# Altium schematic sheet DTMF.SchDoc
size A4
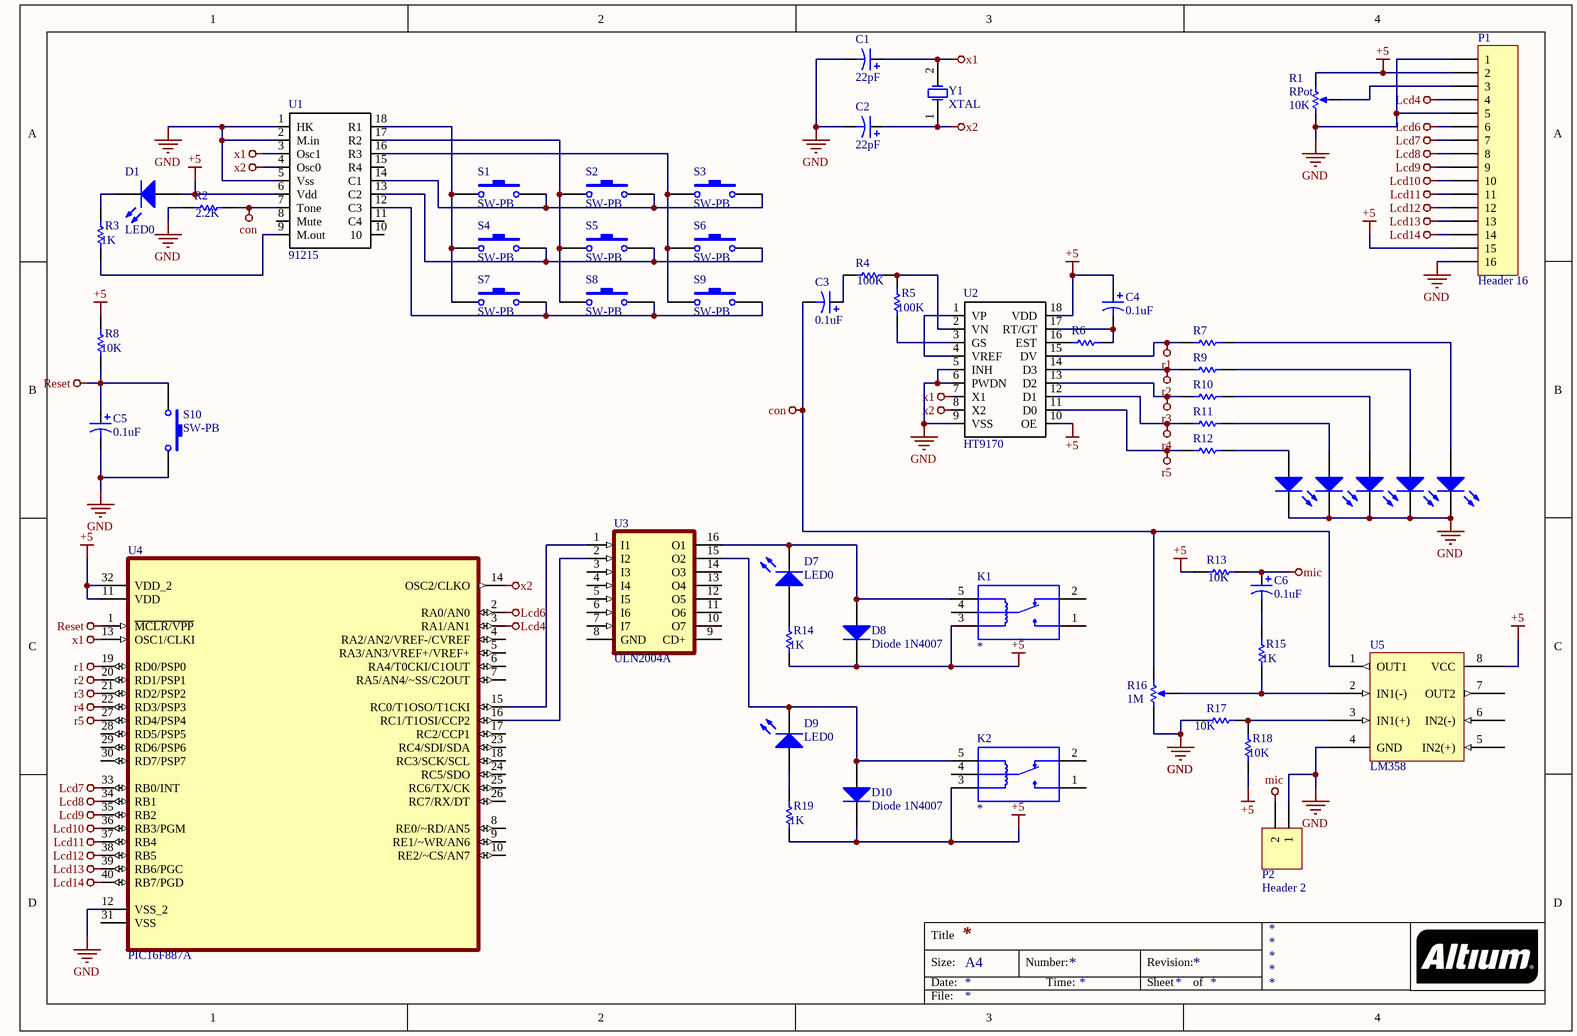
[diagram p0: DTMF.SchDoc]

## Parts
C1  value 22pF  [capacitor]  (hidden comment: cap)
C2  value 22pF  [capacitor]  (hidden comment: cap)
C3  value 0.1uF  [capacitor]  (hidden comment: cap)
C4  value 0.1uF  [capacitor]  (hidden comment: cap)
C5  value 0.1uF  [capacitor]  (hidden comment: cap)
C6  value 0.1uF  [capacitor]  (hidden comment: cap)
D1  LED0  [LED-0]
D2  LED0  [LED-0]  (value not drawn)
D3  LED0  [LED-0]  (value not drawn)
D4  LED0  [LED-0]  (value not drawn)
D5  LED0  [LED-0]  (value not drawn)
D6  LED0  [LED-0]  (value not drawn)
D7  LED0  [LED-0]
D8  Diode 1N4007  [DO-41]
D9  LED0  [LED-0]
D10  Diode 1N4007  [DO-41]
K1  1-1721150-0  [RELAY_ORWH-SH-105D1F,000]  (value not drawn)
K2  1-1721150-0  [RELAY_ORWH-SH-105D1F,000]  (value not drawn)
P1  Header 16  [HDR1X16]
P2  Header 2  [HDR1X2]
R1  RPot  value 10K  [VR5]
R2  value 2.2K  [AXIAL-0.3]  (hidden comment: Res1)
R3  value 1K  [AXIAL-0.3]  (hidden comment: Res1)
R4  value 100K  [AXIAL-0.3]  (hidden comment: Res1)
R5  value 100K  [AXIAL-0.3]  (hidden comment: Res1)
R6  Res1  [AXIAL-0.3]  (value not drawn)
R7  Res1  [AXIAL-0.3]  (value not drawn)
R8  value 10K  [AXIAL-0.3]  (hidden comment: Res1)
R9  Res1  [AXIAL-0.3]  (value not drawn)
R10  Res1  [AXIAL-0.3]  (value not drawn)
R11  Res1  [AXIAL-0.3]  (value not drawn)
R12  Res1  [AXIAL-0.3]  (value not drawn)
R13  value 10K  [AXIAL-0.3]  (hidden comment: Res1)
R14  value 1K  [AXIAL-0.3]  (hidden comment: Res1)
R15  value 1K  [AXIAL-0.3]  (hidden comment: Res1)
R16  value 1M  [VR5]  (hidden comment: RPot)
R17  value 10K  [AXIAL-0.3]  (hidden comment: Res1)
R18  value 10K  [AXIAL-0.3]  (hidden comment: Res1)
R19  value 1K  [AXIAL-0.3]  (hidden comment: Res1)
S1  SW-PB  [SPST-2]
S2  SW-PB  [SPST-2]
S3  SW-PB  [SPST-2]
S4  SW-PB  [SPST-2]
S5  SW-PB  [SPST-2]
S6  SW-PB  [SPST-2]
S7  SW-PB  [SPST-2]
S8  SW-PB  [SPST-2]
S9  SW-PB  [SPST-2]
S10  SW-PB  [SPST-2]
U1  91215  [HT9170]
U2  HT9170  [HT9170]
U3  ULN2004A  [ULN2004A]
U4  PIC16F887A  [PIC16F887A]
U5  LM358  [LM358]
Y1  XTAL  [R38]

## Nets
+5: C4.1 D1.1(A) D8.2(K) D10.2(K) K1.3(C1) K2.3(C1) P1.2 P1.15 R1.2(BOT) R8.2 R13.1 R14.1 R18.1 R19.1 U1.6(Vdd) U2.10(OE) U2.18(VDD) U4.11(VDD) U4.32(VDD_2) U5.8(VCC)
con: C3.2 R2.2 R16.2(BOT) U1.7(Tone) U5.1(OUT1)
GND: C1.2 C2.2 C5.2 D2.2(K) D3.2(K) D4.2(K) D5.2(K) D6.2(K) P1.1 P1.5 P1.16 P2.1 R1.1(TOP) R2.1 R16.1(TOP) R17.1 S10.2 U1.1(HK) U1.2(M.in) U1.5(Vss) U2.5(INH) U2.6(PWDN) U2.9(VSS) U4.12(VSS_2) U5.4(GND)
Lcd4: P1.4 U4.3(RA1/AN1)
Lcd6: P1.6 U4.2(RA0/AN0)
Lcd7: P1.7 U4.33(RB0/INT)
Lcd8: P1.8 U4.34(RB1)
Lcd9: P1.9 U4.35(RB2)
Lcd10: P1.10 U4.36(RB3/PGM)
Lcd11: P1.11 U4.37(RB4)
Lcd12: P1.12 U4.38(RB5)
Lcd13: P1.13 U4.39(RB6/PGC)
Lcd14: P1.14 U4.40(RB7/PGD)
mic: C6.1 P2.2 R13.2
r1: R7.1 U2.15(DV) U4.19(RD0/PSP0)
r2: R9.1 U2.14(D3) U4.20(RD1/PSP1)
r3: R10.1 U2.13(D2) U4.21(RD2/PSP2)
r4: R11.1 U2.12(D1) U4.22(RD3/PSP3)
r5: R12.1 U2.11(D0) U4.27(RD4/PSP4)
Reset: C5.1 R8.1 S10.1 U4.1(~{MCLR/VPP})
x1: C1.1 U1.3(Osc1) U2.7(X1) U4.13(OSC1/CLKI) Y1.2(OSC2)
x2: C2.1 U1.4(Osc0) U2.8(X2) U4.14(OSC2/CLKO) Y1.1(OSC1)
NetC3_1: C3.1 R4.1
NetC4_2: C4.2 R6.2 U2.17(RT/GT)
NetC6_2: C6.2 R15.2
NetD1_2: D1.2(K) R3.2
NetD2_1: D2.1(A) R12.2
NetD3_1: D3.1(A) R11.2
NetD4_1: D4.1(A) R10.2
NetD5_1: D5.1(A) R9.2
NetD6_1: D6.1(A) R7.2
NetD7_1: D7.1(A) R14.2
NetD7_2: D7.2(K) D8.1(A) K1.5(C2) U3.16(O1)
NetD9_1: D9.1(A) R19.2
NetD9_2: D9.2(K) D10.1(A) K2.5(C2) U3.15(O2)
NetP1_3: P1.3 R1.3(TAP)
NetR3_1: R3.1 U1.9(M.out)
NetR4_2: R4.2 R5.2 U2.2(VN)
NetR5_1: R5.1 U2.3(GS)
NetR6_1: R6.1 U2.16(EST)
NetR15_1: R15.1 R16.3(TAP) U5.2(IN1(-))
NetR17_2: R17.2 R18.2 U5.3(IN1(+))
NetS1_1: S1.1 S4.1 S7.1 U1.18(R1)
NetS1_2: S1.2 S2.2 S3.2 U1.14(C1)
NetS2_1: S2.1 S5.1 S8.1 U1.17(R2)
NetS3_1: S3.1 S6.1 S9.1 U1.16(R3)
NetS4_2: S4.2 S5.2 S6.2 U1.13(C2)
NetS7_2: S7.2 S8.2 S9.2 U1.12(C3)
NetU2_1: U2.1(VP) U2.4(VREF)
NetU3_1: U3.1(I1) U4.15(RC0/T1OSO/T1CKI)
NetU3_2: U3.2(I2) U4.16(RC1/T1OSI/CCP2)

Not connected (* = marked no-connect by the designer): K1 1(NO) 2(NC) 4(C); K2 1(NO) 2(NC) 4(C); U1 8(Mute) 10 11(C4) 15(R4); U3 3(I3) 4(I4) 5(I5) 6(I6) 7(I7) 8(GND) 9(CD+) 10(O7) 11(O6) 12(O5) 13(O4) 14(O3); U4 4(RA2/AN2/VREF-/CVREF) 5(RA3/AN3/VREF+/VREF+) 6(RA4/T0CKI/C1OUT) 7(RA5/AN4/~SS/C2OUT) 8(RE0/~RD/AN5) 9(RE1/~WR/AN6) 10(RE2/~CS/AN7) 17(RC2/CCP1) 18(RC3/SCK/SCL) 23(RC4/SDI/SDA) 24(RC5/SDO) 25(RC6/TX/CK) 26(RC7/RX/DT) 28(RD5/PSP5) 29(RD6/PSP6) 30(RD7/PSP7) 31(VSS); U5 5(IN2(+)) 6(IN2(-)) 7(OUT2)

## Notes on the sheet
- Title
- Size:
- Date:
- A4
- Number:
- Time:
- Revision:
- Sheet
- of
- File:

## Library data of the parts
D1-D7 D9 = LED0: Typical INFRARED GaAs LED; Published: 8-Jun-2000; LatestRevisionDate: 08-Jul-2005; LatestRevisionNote: Mech Layer 1 removed.; PackageReference: LED-0; Publisher: Altium Limited; PackageDescription: LED; 2 Leads
D8 D10 = Diode 1N4007: 1 Amp General Purpose Rectifier; Published: 8-Jun-2000; LatestRevisionDate: 17-Jul-2002; LatestRevisionNote: Re-released for DXP Platform.; DatasheetVersion: 1998; PackageVersion: Aug-1999; PackageReference: DO-41; Publisher: Altium Limited; PackageDescription: Diode, Axial; Body 5.2 x 2.7 mm (LxDia. max), Lead Dia. 0.86 mm (max); Code_JEDEC: DO-204-AL; ComponentLink1Description: Manufacturer Link; ComponentLink1URL: http://www.fairchildsemi.com/; ComponentLink2Description: Datasheet; ComponentLink2URL: http://www.fairchildsemi.com/ds/1N%2F1N4001.pdf
K1 K2 = ORWH-SH-105D1F,000: Electromechanical Relay 5VDC 15A SPDT __ 19.2mm 15.5mm 15mm__ THT General Purpose Relay; MF: TE Connectivity; Price: None; Value: *; TE_purchase_URL: https://www.te.com/usa-en/product-1-1721150-0.html?te_bu=Cor&te_type=disp&te_campaign=seda_glo_cor-seda-global-disp-prtnr-fy19-seda-model-bom-cta_sma-317_1&elqCampaignId=32493; Package: None; SnapEDA_Link: https://www.snapeda.com/parts/ORWH-SH-105D1F%2C000/TE%20Connectivity%20Potter%20%26%20Brumfield%20Relays/view-part/573992/?ref=snap; MP: ORWH-SH-105D1F,000; Availability: Unavailable; Comment_1: *
P1 = Header 16: Header, 16-Pin; LatestRevisionDate: 17-Jul-2002; LatestRevisionNote: Re-released for DXP Platform.; Publisher: Altium Limited
P2 = Header 2: Header, 2-Pin; LatestRevisionDate: 17-Jul-2002; LatestRevisionNote: Re-released for DXP Platform.; Publisher: Altium Limited
R1 R16 = RPot: Potentiometer; Sim Note: Enter the Resistance value and the set point into parameter fields.; Set Position: 0.5; Published: 8-Jun-2000; LatestRevisionDate: 17-Jul-2002; LatestRevisionNote: Re-released for DXP Platform.; PackageReference: VR5; Publisher: Altium Limited; PackageDescription: Variable Resistor, Thru-Hole; 3 Leads
R2-R5 R8 R13-R15 R17-R19 = Res1: Resistor; Published: 8-Jun-2000; LatestRevisionDate: 17-Jul-2002; LatestRevisionNote: Re-released for DXP Platform.; PackageReference: AXIAL-0.3; Publisher: Altium Limited; PackageDescription: Axial Device, Thru-Hole; 2 Leads; 0.3 in Pin Spacing
R6 = Res1: Resistor; Value: 330; Published: 8-Jun-2000; LatestRevisionDate: 17-Jul-2002; LatestRevisionNote: Re-released for DXP Platform.; PackageReference: AXIAL-0.3; Publisher: Altium Limited; PackageDescription: Axial Device, Thru-Hole; 2 Leads; 0.3 in Pin Spacing
R7 R9-R12 = Res1: Resistor; Value: 4.7K; Published: 8-Jun-2000; LatestRevisionDate: 17-Jul-2002; LatestRevisionNote: Re-released for DXP Platform.; PackageReference: AXIAL-0.3; Publisher: Altium Limited; PackageDescription: Axial Device, Thru-Hole; 2 Leads; 0.3 in Pin Spacing
S1-S10 = SW-PB: Switch; Published: 24-Mar-1999; LatestRevisionDate: 17-Jul-2002; LatestRevisionNote: Re-released for DXP Platform.; PackageReference: SPST-2; Publisher: Altium Limited; PackageDescription: Switch; 2 Leads
U2 = HT9170: MF: Holtek; MP: HT9170B; Price: None; Value: *; Availability: Unavailable; SnapEDA_Link: https://www.snapeda.com/parts/HT9170B/Holtek/view-part/105806/?ref=snap; Package: None
U3 = ULN2004A: MF: STMicroelectronics; DigiKey-Purchase-URL: https://snapeda.com/shop?store=DigiKey&id=45236; Package: DIP-16 STMicroelectronics; MP: ULN2004A; Value: *; SnapEDA_Link: https://www.snapeda.com/parts/ULN2004A/STMicroelectronics/view-part/45236/?ref=snap; Availability: Unavailable; Price: None
U4 = PIC16F877A-I/P: PIC PICÂ® 16F Microcontroller IC 8-Bit 20MHz 14KB _8K x 14_ FLASH 40-PDIP; MF: Microchip; MP: PIC16F877A-I/P; Package: DIP-40 Microchip; Price: None; Value: *; SnapEDA_Link: https://www.snapeda.com/parts/PIC16F877A-I/P/Microchip/view-part/1877145/?ref=snap; Availability: Unavailable
Y1 = XTAL: Crystal Oscillator; Published: 8-Jun-2000; LatestRevisionDate: 17-Jul-2002; LatestRevisionNote: Re-released for DXP Platform.; PackageReference: R38; Publisher: Altium Limited; PackageDescription: Crystal, Thru-Hole; 2 Leads; Body 3.1 x 8.2 mm (Dia.xH)